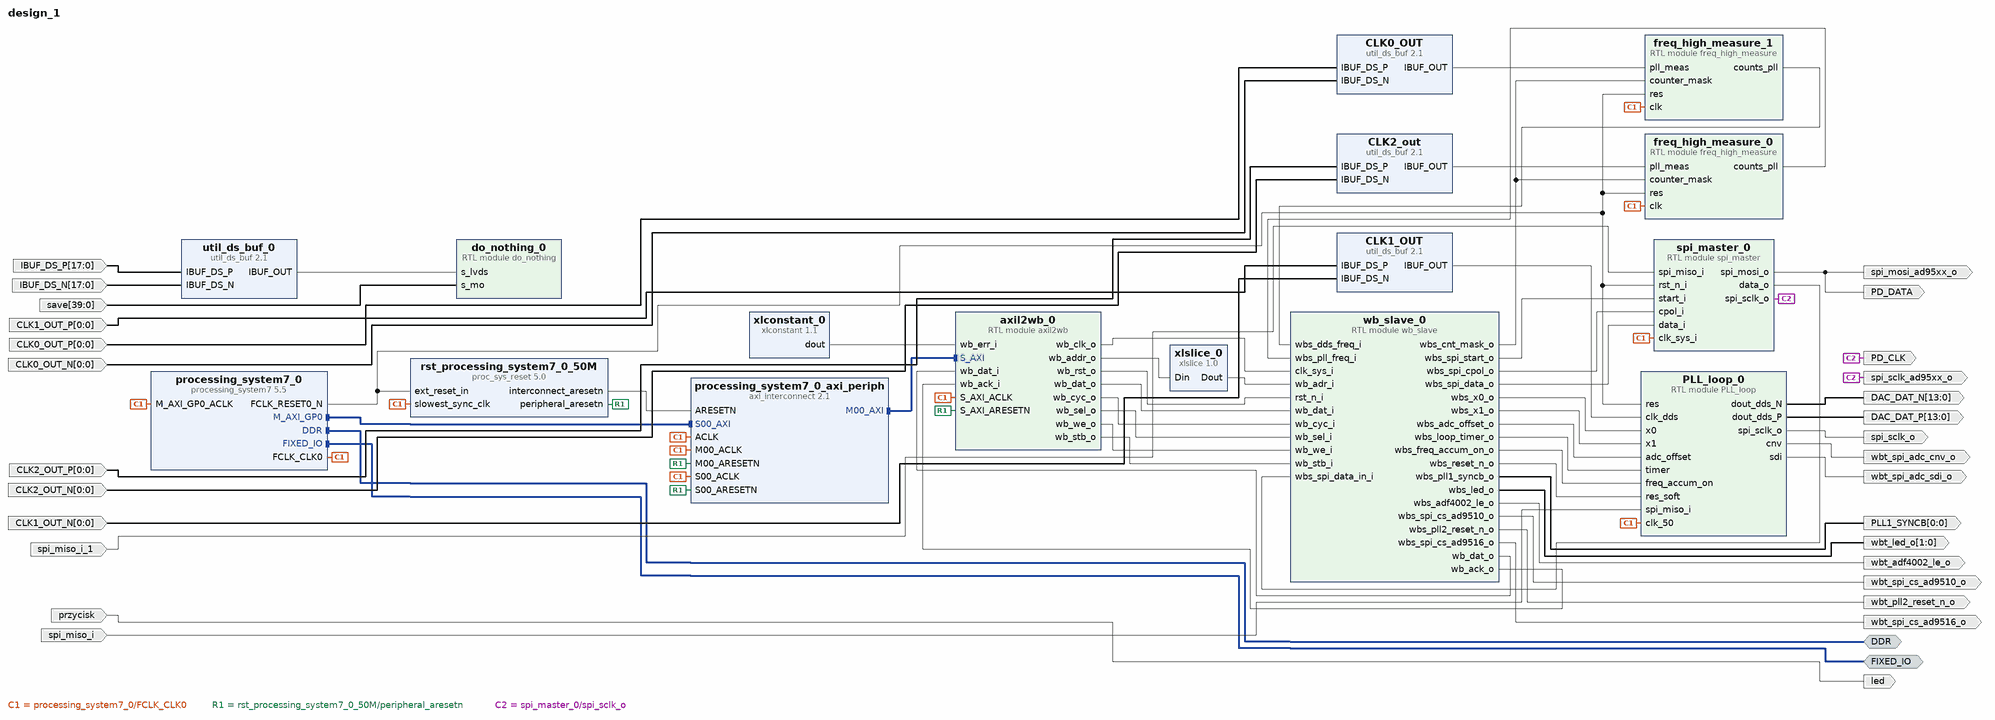
[diagram p0: block diagram of the top level]
# Vivado block design design_1, xc7z045ffg900-2, Vivado 2017.1
create_bd_design design_1

create_bd_intf_port -mode Master -vlnv xilinx.com:interface:ddrx_rtl:1.0 DDR
create_bd_intf_port -mode Master -vlnv xilinx.com:display_processing_system7:fixedio_rtl:1.0 FIXED_IO
create_bd_port -dir I -from 17 -to 0 -type clk IBUF_DS_P
create_bd_port -dir I -from 17 -to 0 -type clk IBUF_DS_N
create_bd_port -dir I -from 39 -to 0 save
create_bd_port -dir I -from 0 -to 0 -type clk CLK1_OUT_P
create_bd_port -dir I -from 0 -to 0 -type clk CLK1_OUT_N
create_bd_port -dir I -from 0 -to 0 -type clk CLK0_OUT_P
create_bd_port -dir I -from 0 -to 0 -type clk CLK0_OUT_N
create_bd_port -dir I -from 0 -to 0 -type clk CLK2_OUT_P
create_bd_port -dir I -from 0 -to 0 -type clk CLK2_OUT_N
create_bd_port -dir I przycisk
create_bd_port -dir O led
create_bd_port -dir O PD_CLK
create_bd_port -dir O spi_sclk_ad95xx_o
create_bd_port -dir O PD_DATA
create_bd_port -dir O spi_mosi_ad95xx_o
create_bd_port -dir I spi_miso_i_1
create_bd_port -dir I spi_miso_i
create_bd_port -dir O wbt_spi_adc_cnv_o
create_bd_port -dir O wbt_spi_adc_sdi_o
create_bd_port -dir O spi_sclk_o
create_bd_port -dir O -from 1 -to 0 wbt_led_o
create_bd_port -dir O -from 0 -to 0 PLL1_SYNCB
create_bd_port -dir O wbt_spi_cs_ad9516_o
create_bd_port -dir O wbt_spi_cs_ad9510_o
create_bd_port -dir O wbt_adf4002_le_o
create_bd_port -dir O wbt_pll2_reset_n_o
create_bd_port -dir O -from 13 -to 0 -type clk DAC_DAT_P
create_bd_port -dir O -from 13 -to 0 -type clk DAC_DAT_N

create_bd_cell -type ip -vlnv xilinx.com:ip:processing_system7:5.5 processing_system7_0
set_property -dict [list \
  CONFIG.PCW_UIPARAM_DDR_FREQ_MHZ 533.333313 \
  CONFIG.PCW_CPU_CPU_6X4X_MAX_RANGE 800 \
  CONFIG.PCW_APU_PERIPHERAL_FREQMHZ 667.000000 \
  CONFIG.PCW_SDIO_PERIPHERAL_FREQMHZ 50 \
  CONFIG.PCW_UART_PERIPHERAL_FREQMHZ 50 \
  CONFIG.PCW_FPGA0_PERIPHERAL_FREQMHZ 50 \
  CONFIG.PCW_FPGA1_PERIPHERAL_FREQMHZ 50 \
  CONFIG.PCW_M_AXI_GP0_FREQMHZ 10 \
  CONFIG.PCW_PERIPHERAL_BOARD_PRESET part0 \
  CONFIG.PCW_PRESET_BANK0_VOLTAGE {LVCMOS 1.8V} \
  CONFIG.PCW_PRESET_BANK1_VOLTAGE {LVCMOS 1.8V} \
  CONFIG.PCW_UIPARAM_DDR_PARTNO Custom \
  CONFIG.PCW_QSPI_PERIPHERAL_ENABLE 1 \
  CONFIG.PCW_QSPI_INTERNAL_HIGHADDRESS 0xFDFFFFFF \
  CONFIG.PCW_ENET0_PERIPHERAL_ENABLE 1 \
  CONFIG.PCW_SD0_PERIPHERAL_ENABLE 1 \
  CONFIG.PCW_SD0_SD0_IO {MIO 40 .. 45} \
  CONFIG.PCW_SD0_GRP_CD_ENABLE 1 \
  CONFIG.PCW_SD0_GRP_CD_IO {MIO 14} \
  CONFIG.PCW_SD0_GRP_WP_ENABLE 1 \
  CONFIG.PCW_SD0_GRP_WP_IO {MIO 15} \
  CONFIG.PCW_UART1_PERIPHERAL_ENABLE 1 \
  CONFIG.PCW_UART1_UART1_IO {MIO 48 .. 49} \
  CONFIG.PCW_TTC0_PERIPHERAL_ENABLE 1 \
  CONFIG.PCW_USB0_PERIPHERAL_ENABLE 1 \
  CONFIG.PCW_USB_RESET_ENABLE 1 \
  CONFIG.PCW_I2C0_PERIPHERAL_ENABLE 1 \
  CONFIG.PCW_I2C_RESET_ENABLE 1 \
  CONFIG.PCW_GPIO_MIO_GPIO_ENABLE 1 \
  CONFIG.PCW_GPIO_MIO_GPIO_IO MIO \
  CONFIG.preset ZC706 \
] [get_bd_cells processing_system7_0]
# 475 more settings of processing_system7_0 are not shown: defaults, MIO pin electricals, DDR timing, and values the tool derives
create_bd_cell -type ip -vlnv xilinx.com:ip:axi_interconnect:2.1 processing_system7_0_axi_periph
set_property -dict {CONFIG.NUM_MI 1} [get_bd_cells processing_system7_0_axi_periph]
create_bd_cell -type ip -vlnv xilinx.com:ip:proc_sys_reset:5.0 rst_processing_system7_0_50M
create_bd_cell -type ip -vlnv xilinx.com:ip:xlconstant:1.1 xlconstant_0
set_property -dict {CONFIG.CONST_VAL 0} [get_bd_cells xlconstant_0]
create_bd_cell -type ip -vlnv xilinx.com:ip:util_ds_buf:2.1 util_ds_buf_0
set_property -dict {CONFIG.C_SIZE 18} [get_bd_cells util_ds_buf_0]
create_bd_cell -type ip -vlnv xilinx.com:ip:util_ds_buf:2.1 CLK1_OUT
create_bd_cell -type ip -vlnv xilinx.com:ip:util_ds_buf:2.1 CLK0_OUT
create_bd_cell -type ip -vlnv xilinx.com:ip:util_ds_buf:2.1 CLK2_out
create_bd_cell -type module -reference spi_master spi_master_0
create_bd_cell -type ip -vlnv xilinx.com:ip:xlslice:1.0 xlslice_0
set_property -dict {CONFIG.DIN_FROM 4 CONFIG.DOUT_WIDTH 5} [get_bd_cells xlslice_0]
create_bd_cell -type module -reference axil2wb axil2wb_0
create_bd_cell -type module -reference do_nothing do_nothing_0
create_bd_cell -type module -reference freq_high_measure freq_high_measure_0
create_bd_cell -type module -reference freq_high_measure freq_high_measure_1
create_bd_cell -type module -reference wb_slave wb_slave_0
create_bd_cell -type module -reference PLL_loop PLL_loop_0

# ---- connections ----

connect_bd_intf_net [get_bd_intf_pins processing_system7_0/M_AXI_GP0] [get_bd_intf_pins processing_system7_0_axi_periph/S00_AXI]
connect_bd_intf_net [get_bd_intf_pins processing_system7_0_axi_periph/M00_AXI] [get_bd_intf_pins axil2wb_0/S_AXI]
connect_bd_intf_net [get_bd_intf_ports DDR] [get_bd_intf_pins processing_system7_0/DDR]
connect_bd_intf_net [get_bd_intf_ports FIXED_IO] [get_bd_intf_pins processing_system7_0/FIXED_IO]
connect_bd_net [get_bd_pins processing_system7_0/FCLK_CLK0] \
  [get_bd_pins processing_system7_0/M_AXI_GP0_ACLK] [get_bd_pins rst_processing_system7_0_50M/slowest_sync_clk] \
  [get_bd_pins spi_master_0/clk_sys_i] [get_bd_pins axil2wb_0/S_AXI_ACLK] [get_bd_pins freq_high_measure_0/clk] \
  [get_bd_pins freq_high_measure_1/clk] [get_bd_pins processing_system7_0_axi_periph/ACLK] \
  [get_bd_pins processing_system7_0_axi_periph/S00_ACLK] [get_bd_pins processing_system7_0_axi_periph/M00_ACLK] \
  [get_bd_pins PLL_loop_0/clk_50]
connect_bd_net [get_bd_pins processing_system7_0/FCLK_RESET0_N] \
  [get_bd_pins rst_processing_system7_0_50M/ext_reset_in] [get_bd_pins spi_master_0/rst_n_i] \
  [get_bd_pins freq_high_measure_0/res] [get_bd_pins freq_high_measure_1/res] [get_bd_pins PLL_loop_0/res]
connect_bd_net [get_bd_pins rst_processing_system7_0_50M/peripheral_aresetn] \
  [get_bd_pins axil2wb_0/S_AXI_ARESETN] [get_bd_pins processing_system7_0_axi_periph/S00_ARESETN] \
  [get_bd_pins processing_system7_0_axi_periph/M00_ARESETN]
connect_bd_net [get_bd_pins rst_processing_system7_0_50M/interconnect_aresetn] [get_bd_pins processing_system7_0_axi_periph/ARESETN]
connect_bd_net [get_bd_pins axil2wb_0/wb_clk_o] [get_bd_pins wb_slave_0/clk_sys_i]
connect_bd_net [get_bd_pins axil2wb_0/wb_rst_o] [get_bd_pins wb_slave_0/rst_n_i]
connect_bd_net [get_bd_pins axil2wb_0/wb_dat_o] [get_bd_pins wb_slave_0/wb_dat_i]
connect_bd_net [get_bd_pins axil2wb_0/wb_cyc_o] [get_bd_pins wb_slave_0/wb_cyc_i]
connect_bd_net [get_bd_pins axil2wb_0/wb_sel_o] [get_bd_pins wb_slave_0/wb_sel_i]
connect_bd_net [get_bd_pins axil2wb_0/wb_we_o] [get_bd_pins wb_slave_0/wb_we_i]
connect_bd_net [get_bd_pins axil2wb_0/wb_stb_o] [get_bd_pins wb_slave_0/wb_stb_i]
connect_bd_net [get_bd_pins xlconstant_0/dout] [get_bd_pins axil2wb_0/wb_err_i]
connect_bd_net [get_bd_ports IBUF_DS_P] [get_bd_pins util_ds_buf_0/IBUF_DS_P]
connect_bd_net [get_bd_ports IBUF_DS_N] [get_bd_pins util_ds_buf_0/IBUF_DS_N]
connect_bd_net [get_bd_pins util_ds_buf_0/IBUF_OUT] [get_bd_pins do_nothing_0/s_lvds]
connect_bd_net [get_bd_ports save] [get_bd_pins do_nothing_0/s_mo]
connect_bd_net -net IBUF_DS_P_1_1 [get_bd_ports CLK1_OUT_P] [get_bd_pins CLK1_OUT/IBUF_DS_P]
connect_bd_net -net IBUF_DS_N_1_1 [get_bd_ports CLK1_OUT_N] [get_bd_pins CLK1_OUT/IBUF_DS_N]
connect_bd_net [get_bd_pins CLK1_OUT/IBUF_OUT] [get_bd_pins PLL_loop_0/clk_dds]
connect_bd_net -net IBUF_DS_P_1_2 [get_bd_ports CLK0_OUT_P] [get_bd_pins CLK0_OUT/IBUF_DS_P]
connect_bd_net -net IBUF_DS_N_1_2 [get_bd_ports CLK0_OUT_N] [get_bd_pins CLK0_OUT/IBUF_DS_N]
connect_bd_net -net IBUF_DS_P_2_1 [get_bd_ports CLK2_OUT_P] [get_bd_pins CLK2_out/IBUF_DS_P]
connect_bd_net -net IBUF_DS_N_2_1 [get_bd_ports CLK2_OUT_N] [get_bd_pins CLK2_out/IBUF_DS_N]
connect_bd_net [get_bd_ports przycisk] [get_bd_ports led]
connect_bd_net [get_bd_pins freq_high_measure_0/counts_pll] [get_bd_pins wb_slave_0/wbs_pll_freq_i]
connect_bd_net [get_bd_pins spi_master_0/spi_sclk_o] [get_bd_ports spi_sclk_ad95xx_o] [get_bd_ports PD_CLK]
connect_bd_net [get_bd_pins spi_master_0/spi_mosi_o] [get_bd_ports spi_mosi_ad95xx_o] [get_bd_ports PD_DATA]
connect_bd_net -net spi_miso_i_1_1 [get_bd_ports spi_miso_i_1] [get_bd_pins spi_master_0/spi_miso_i]
connect_bd_net [get_bd_pins spi_master_0/data_o] [get_bd_pins wb_slave_0/wbs_spi_data_in_i]
connect_bd_net [get_bd_ports spi_miso_i] [get_bd_pins PLL_loop_0/spi_miso_i]
connect_bd_net [get_bd_pins xlslice_0/Dout] [get_bd_pins wb_slave_0/wb_adr_i]
connect_bd_net [get_bd_pins axil2wb_0/wb_addr_o] [get_bd_pins xlslice_0/Din]
connect_bd_net [get_bd_pins PLL_loop_0/cnv] [get_bd_ports wbt_spi_adc_cnv_o]
connect_bd_net [get_bd_pins PLL_loop_0/sdi] [get_bd_ports wbt_spi_adc_sdi_o]
connect_bd_net [get_bd_pins PLL_loop_0/spi_sclk_o] [get_bd_ports spi_sclk_o]
connect_bd_net [get_bd_pins wb_slave_0/wb_dat_o] [get_bd_pins axil2wb_0/wb_dat_i]
connect_bd_net [get_bd_pins wb_slave_0/wb_ack_o] [get_bd_pins axil2wb_0/wb_ack_i]
connect_bd_net [get_bd_pins wb_slave_0/wbs_led_o] [get_bd_ports wbt_led_o]
connect_bd_net [get_bd_pins wb_slave_0/wbs_pll1_syncb_o] [get_bd_ports PLL1_SYNCB]
connect_bd_net [get_bd_pins wb_slave_0/wbs_cnt_mask_o] [get_bd_pins freq_high_measure_0/counter_mask] [get_bd_pins freq_high_measure_1/counter_mask]
connect_bd_net [get_bd_pins wb_slave_0/wbs_spi_start_o] [get_bd_pins spi_master_0/start_i]
connect_bd_net [get_bd_pins wb_slave_0/wbs_spi_cpol_o] [get_bd_pins spi_master_0/cpol_i]
connect_bd_net [get_bd_pins wb_slave_0/wbs_spi_cs_ad9516_o] [get_bd_ports wbt_spi_cs_ad9516_o]
connect_bd_net [get_bd_pins wb_slave_0/wbs_spi_cs_ad9510_o] [get_bd_ports wbt_spi_cs_ad9510_o]
connect_bd_net [get_bd_pins wb_slave_0/wbs_spi_data_o] [get_bd_pins spi_master_0/data_i]
connect_bd_net [get_bd_pins wb_slave_0/wbs_adf4002_le_o] [get_bd_ports wbt_adf4002_le_o]
connect_bd_net [get_bd_pins wb_slave_0/wbs_pll2_reset_n_o] [get_bd_ports wbt_pll2_reset_n_o]
connect_bd_net [get_bd_pins wb_slave_0/wbs_x0_o] [get_bd_pins PLL_loop_0/x0]
connect_bd_net [get_bd_pins wb_slave_0/wbs_x1_o] [get_bd_pins PLL_loop_0/x1]
connect_bd_net [get_bd_pins wb_slave_0/wbs_adc_offset_o] [get_bd_pins PLL_loop_0/adc_offset]
connect_bd_net [get_bd_pins wb_slave_0/wbs_loop_timer_o] [get_bd_pins PLL_loop_0/timer]
connect_bd_net [get_bd_pins PLL_loop_0/dout_dds_P] [get_bd_ports DAC_DAT_P]
connect_bd_net [get_bd_pins PLL_loop_0/dout_dds_N] [get_bd_ports DAC_DAT_N]
connect_bd_net [get_bd_pins freq_high_measure_1/counts_pll] [get_bd_pins wb_slave_0/wbs_dds_freq_i]
connect_bd_net [get_bd_pins CLK0_OUT/IBUF_OUT] [get_bd_pins freq_high_measure_1/pll_meas]
connect_bd_net [get_bd_pins CLK2_out/IBUF_OUT] [get_bd_pins freq_high_measure_0/pll_meas]
connect_bd_net [get_bd_pins wb_slave_0/wbs_freq_accum_on_o] [get_bd_pins PLL_loop_0/freq_accum_on]
connect_bd_net [get_bd_pins wb_slave_0/wbs_reset_n_o] [get_bd_pins PLL_loop_0/res_soft]

# ---- address map ----
assign_bd_address -offset 0x43C00000 -range 64K -target_address_space [get_bd_addr_spaces processing_system7_0/Data] [get_bd_addr_segs axil2wb_0/S_AXI/reg0]

validate_bd_design
save_bd_design
